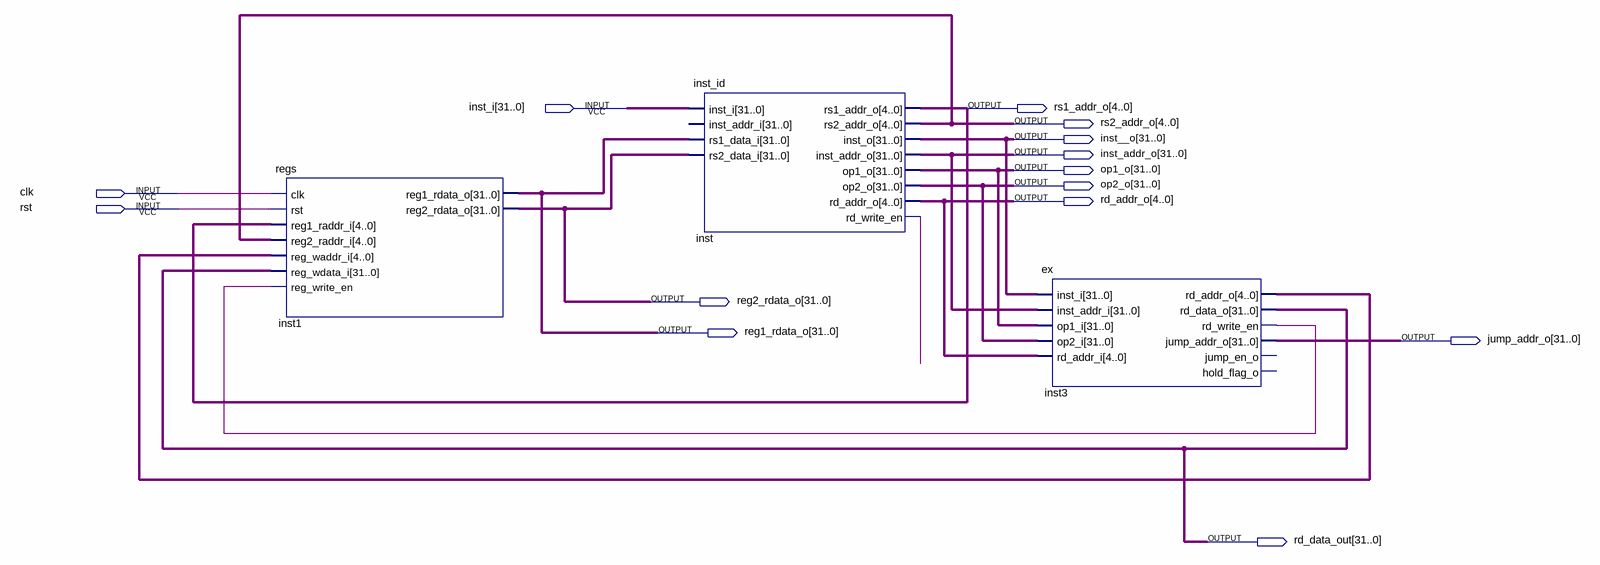
[diagram p0: schematic sheet]
// Quartus schematic rwRAM.bdf as structural Verilog: 3 symbols, 14 pins
module rwRAM (
  input  [31:0] inst_i,
  input  clk,
  input  rst,
  output [4:0] rs1_addr_o,
  output [4:0] rs2_addr_o,
  output [31:0] inst__o,
  output [31:0] inst_addr_o,
  output [31:0] op1_o,
  output [31:0] op2_o,
  output [4:0] rd_addr_o,
  output [31:0] reg2_rdata_o,
  output [31:0] reg1_rdata_o,
  output [31:0] jump_addr_o,
  output [31:0] rd_data_out
);

  wire inst3_rd_write_en, inst_rd_write_en;
  wire [4:0] inst3_rd_addr_o;

  regs inst1 (
    .clk(clk), .rst(rst), .reg1_raddr_i(rs1_addr_o), .reg2_raddr_i(rs2_addr_o),
    .reg_waddr_i(inst3_rd_addr_o), .reg_wdata_i(rd_data_out), .reg_write_en(inst3_rd_write_en),
    .reg1_rdata_o(reg1_rdata_o), .reg2_rdata_o(reg2_rdata_o));
  inst_id inst (
    .inst_i(inst_i), .rs1_data_i(reg1_rdata_o), .rs2_data_i(reg2_rdata_o), .rs1_addr_o(rs1_addr_o),
    .rs2_addr_o(rs2_addr_o), .inst_o(inst__o), .inst_addr_o(inst_addr_o), .op1_o(op1_o), .op2_o(op2_o),
    .rd_addr_o(rd_addr_o), .rd_write_en(inst_rd_write_en));  // open: inst_addr_i
  ex inst3 (
    .inst_i(inst__o), .inst_addr_i(inst_addr_o), .op1_i(op1_o), .op2_i(op2_o), .rd_addr_i(rd_addr_o),
    .rd_addr_o(inst3_rd_addr_o), .rd_data_o(rd_data_out), .rd_write_en(inst3_rd_write_en),
    .jump_addr_o(jump_addr_o));  // open: jump_en_o, hold_flag_o
endmodule
